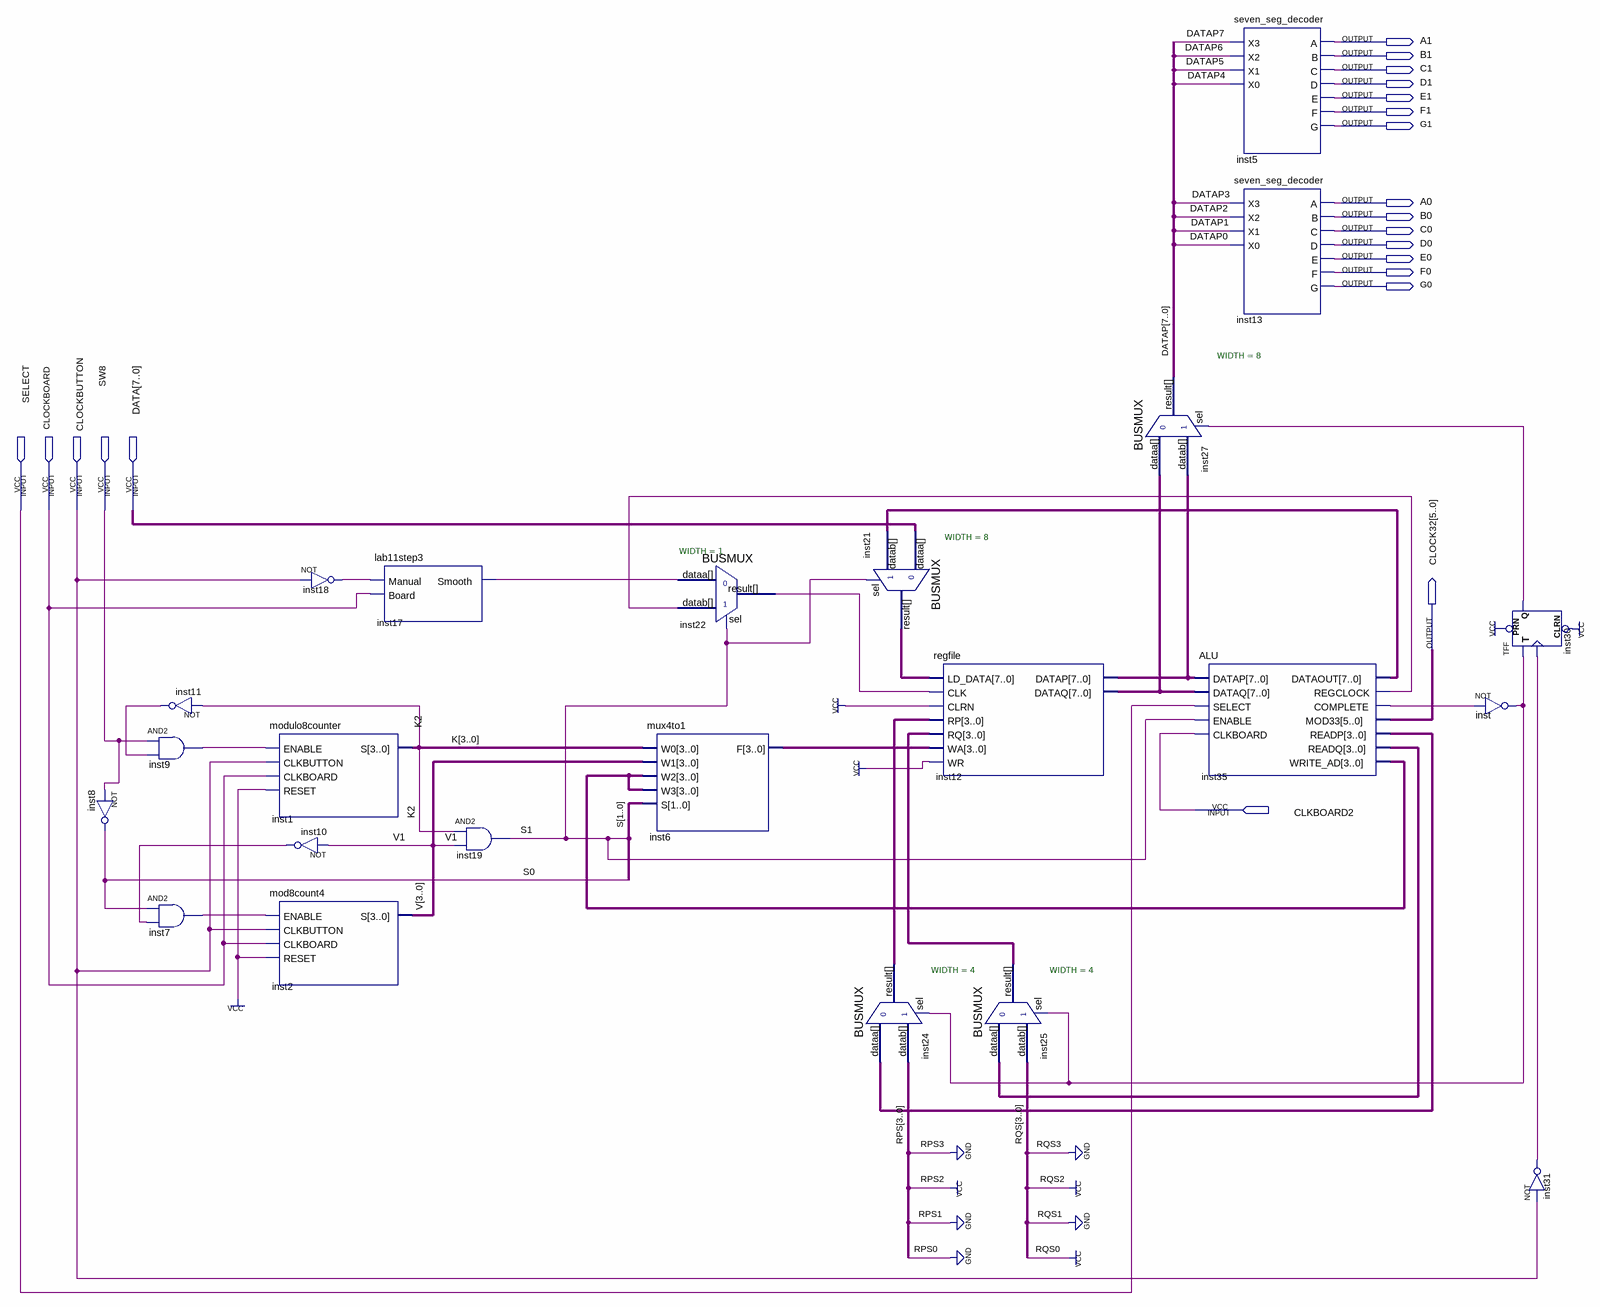
[diagram p0: schematic sheet]
// Quartus schematic FinalAssembly.bdf as structural Verilog: 23 symbols, 21 pins
module FinalAssembly (
  input  SELECT,
  input  CLOCKBOARD,
  input  CLOCKBUTTON,
  input  SW8,
  input  [7:0] DATA,
  input  CLKBOARD2,
  output A1,
  output B1,
  output C1,
  output D1,
  output E1,
  output F1,
  output G1,
  output A0,
  output B0,
  output C0,
  output D0,
  output E0,
  output F0,
  output G0,
  output [5:0] CLOCK32
);

  wire inst7_out, inst9_out, inst10_out, inst11_out, inst17_smooth, inst18_out, inst22_result, inst30_q,
       inst31_out, inst35_complete, inst35_regclock, inst_out;
  wire [1:0] S;
  wire [3:0] inst6_f, inst24_result, inst25_result, inst35_readp, inst35_readq, inst35_write_ad, K, V;
  wire [7:0] DATAP, inst12_datap, inst12_dataq, inst21_result, inst35_dataout;

  not inst8 (S[0], SW8);
  not inst11 (inst11_out, K[2]);
  and inst9 (inst9_out, SW8, inst11_out);
  and inst7 (inst7_out, S[0], inst10_out);
  modulo8counter inst1 (.ENABLE(inst9_out), .CLKBUTTON(CLOCKBUTTON), .CLKBOARD(CLOCKBOARD), .RESET(1'b1), .S(K));
  not inst10 (inst10_out, V[1]);
  mod8count4 inst2 (.ENABLE(inst7_out), .CLKBUTTON(CLOCKBUTTON), .CLKBOARD(CLOCKBOARD), .RESET(1'b1), .S(V));
  not inst18 (inst18_out, CLOCKBUTTON);
  lab11step3 inst17 (.Manual(inst18_out), .Board(CLOCKBOARD), .Smooth(inst17_smooth));
  and inst19 (S[1], K[2], V[1]);
  BUSMUX #(.WIDTH(1)) inst22 (.datab(inst35_regclock), .sel(S[1]), .dataa(inst17_smooth), .result(inst22_result));
  mux4to1 inst6 (.W0(K), .W1(V), .W2(inst35_write_ad), .W3(inst35_write_ad), .S(S), .F(inst6_f));
  BUSMUX #(.WIDTH(4)) inst24 (.datab(4'b0100), .sel(inst_out), .dataa(inst35_readp), .result(inst24_result));
  BUSMUX #(.WIDTH(8)) inst21 (.datab(inst35_dataout), .sel(S[1]), .dataa(DATA), .result(inst21_result));
  regfile inst12 (
    .LD_DATA(inst21_result), .CLK(inst22_result), .CLRN(1'b1), .RP(inst24_result), .RQ(inst25_result),
    .WA(inst6_f), .WR(1'b1), .DATAP(inst12_datap), .DATAQ(inst12_dataq));
  BUSMUX #(.WIDTH(4)) inst25 (.datab(4'b0101), .sel(inst_out), .dataa(inst35_readq), .result(inst25_result));
  BUSMUX #(.WIDTH(8)) inst27 (.datab(inst12_datap), .sel(inst30_q), .dataa(inst12_dataq), .result(DATAP));
  seven_seg_decoder inst5 (
    .X3(DATAP[7]), .X2(DATAP[6]), .X1(DATAP[5]), .X0(DATAP[4]), .A(A1), .B(B1), .C(C1), .D(D1), .E(E1),
    .F(F1), .G(G1));
  seven_seg_decoder inst13 (
    .X3(DATAP[3]), .X2(DATAP[2]), .X1(DATAP[1]), .X0(DATAP[0]), .A(A0), .B(B0), .C(C0), .D(D0), .E(E0),
    .F(F0), .G(G0));
  ALU inst35 (
    .DATAP(inst12_datap), .DATAQ(inst12_dataq), .SELECT(SELECT), .ENABLE(S[1]), .CLKBOARD(CLKBOARD2),
    .DATAOUT(inst35_dataout), .REGCLOCK(inst35_regclock), .COMPLETE(inst35_complete), .MOD33(CLOCK32),
    .READP(inst35_readp), .READQ(inst35_readq), .WRITE_AD(inst35_write_ad));
  TFF inst30 (.PRN(1'b1), .CLRN(1'b1), .T(inst_out), .CLK(inst31_out), .Q(inst30_q));
  not inst (inst_out, inst35_complete);
  not inst31 (inst31_out, CLOCKBUTTON);
endmodule
